# EasyEDA Pro project ProPrj_NavBot-EN01_2025-11-07.epro, board SERVO_DEBUG
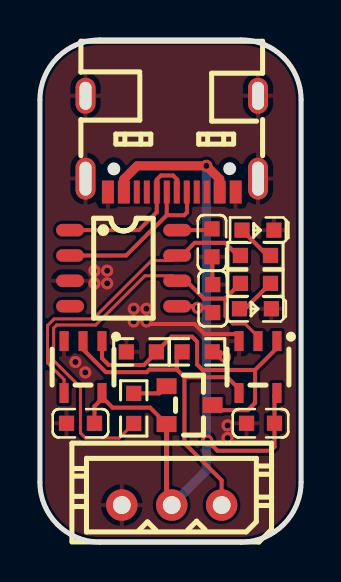
[diagram p10: board, top side]
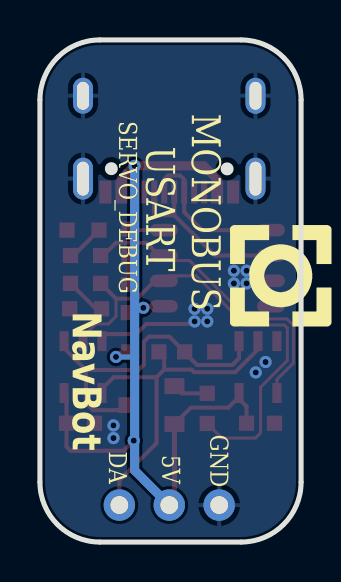
[diagram p11: board, bottom side, seen from below]

Outline 13.08 x 25.15 mm; copper layers: Top Layer, Bottom Layer. Coordinates in mm from the lower left corner of the outline.
Outline path: 0,22.15 0,3 arc(0.88,0.88) 3,0 10.08,0 arc(12.2,0.88) 13.08,3 13.08,22.15 arc(12.2,24.27) 10.08,25.15 3,25.15 arc(0.88,24.27) 0,22.15
Stack: Top Layer 0.035mm / Dielectric1 1.51mm FR4 er 4.5 / Bottom Layer 0.035mm

## Design rules (mm)
template: 用户自定义配置
spacing Default (default): track to track 0.152, other pairs 0 to 0.152
track width Default (default): min 0.127, default 0.254, max 25.4
differential pair differentialPair (default): width min 0.127, default 0.254, max 2.54; gap min 0.152, default 0.152
via Default (default): diameter min 0.61, default 0.61, max 100.025; hole min 0.305, default 0.305, max 59.995

## Placement (name value [footprint] x y rotation side)
C1  100nF  [C0603]  8.64 12.19 270 top
C2  100nF  [C0603]  8.64 14.99 90 top
C3  100nF  [C0603]  2.03 5.97 180 top
C4  100nF  [C0603]  11.05 5.97 180 top
H2  -  [5264-3A]  11.6 4.95 180 top
LED1  KT-0603R  [LED0603-RD]  10.92 15.62 180 top
LED2  KT-0603R  [LED0603-RD]  10.8 11.68 180 top
Q1  SS8550  [SOT-23_L2.9-W1.3-P0.95-LS2.4-BR]  7.49 6.86 180 top
R1  1kΩ  [R0603]  7.87 9.53 0 top
R2  1kΩ  [R0603]  5.08 9.53 0 top
R5  1kΩ  [R0603]  4.7 6.69 270 top
R6  1kΩ  [R0603]  10.8 14.35 180 top
R7  1kΩ  [R0603]  10.8 12.95 180 top
U2  SN74LVC1G126DBVR  [SOT-23-5_L3.0-W1.7-P0.95-LS2.8-BR]  10.92 8.76 90 top
U3  SN74LVC1G125DBVR  [SOT-23-5_L3.0-W1.7-P0.95-LS2.8-BR]  2.16 8.76 90 top
U4  CH340N  [SOP-8_L4.9-W3.9-P1.27-LS6.0-BL]  4.19 13.72 270 top
USB1  TYPEC-304-ACP16  [USB-C-SMD_TYPE-C-16P-1]  6.6 19.94 180 top

## Footprints (pads in the part's own frame, mm; a bottom-side part is the same pattern mirrored in y, then rotated)
5264-3A
  round 1.575 hole 0.889: 1(2.5,3.1) 2(5,3.1) 3(7.5,3.1)
C0603
  rect 0.762x0.762 smd: 1(-0.7,0.019) 2(0.7,0.019)
LED0603-RD
  rect 0.762x0.762 smd: 1(-0.799,0) 2(0.799,0)
R0603
  rect 0.762x0.762 smd: 1(-0.753,0) 2(0.753,0)
SOP-8_L4.9-W3.9-P1.27-LS6.0-BL
  oval 0.63x1.4 smd: 1(-1.905,-2.683) 2(-0.635,-2.683) 3(0.635,-2.683) 4(1.905,-2.683) 5(1.905,2.683) 6(0.635,2.683) 7(-0.635,2.683) 8(-1.905,2.683)
SOT-23-5_L3.0-W1.7-P0.95-LS2.8-BR
  rect 1x0.457 smd: 1(1.3,-0.95) 2(1.3,0) 3(1.3,0.95) 4(-1.3,0.95) 5(-1.3,-0.95)
SOT-23_L2.9-W1.3-P0.95-LS2.4-BR
  rect 1x0.8 smd: 1(1.15,-0.95) 2(1.15,0.95) 3(-1.15,0)
USB-C-SMD_TYPE-C-16P-1
  rect 0.6x1.15 smd: A1B12(-3.2,2.41) A4B9(-2.4,2.41) B1A12(3.2,2.41) B4A9(2.4,2.41)
  rect 0.3x1.15 smd: A5(-1.25,2.41) A6(-0.25,2.41) A7(0.25,2.41) A8(1.25,2.41) B5(1.75,2.41) B6(0.75,2.41) B7(-0.75,2.41) B8(-1.75,2.41)
  oval 1x2.1 hole 0.6x1.7: EP(-4.32,1.74) EP(4.32,1.74)
  oval 1x1.8 hole 0.6x1.4: EP(-4.32,-2.41) EP(4.32,-2.41)

## Nets
As in the schematic.

Pads without a net: U4 4; USB1 A5 A8 B5 B8

## Via types
v1: diameter 0.61, hole 0.305, Top Layer to Bottom Layer, 16 vias

## Routing (per net, layer and track width the routed paths; a pad name or vN(x,y) marks a point on that pad's centre or on a via; arc(x,y) is an arc through that point)
GND: length 6.6
  Top Layer w0.203: U2.3 9.97,10.41 8.26,10.41 7.75,10.92 5.46,10.92 v1(5.33,11.05) ; 8.64,14.29 8.64,12.89
  vias: v1(1.78,9.02) v1(2.27,8.49) v1(2.73,13.59) v1(2.73,12.95) v1(3.37,13.59) v1(3.37,12.95) v1(4.7,11.68) v1(4.7,11.05) v1(5.33,11.68) v1(9.4,5.84) v1(9.4,5.21)
VIN: length 44
  Top Layer w0.203: 3.11,7.26 3.64,6.73 5.52,6.73 Q1.2 ; 3.11,7.26 U3.5 ; 3.11,7.26 3.11,7.17 2.73,6.8 2.73,5.97 ; U2.5 11.75,7.34 11.75,4.78 11.55,4.57 8.89,4.57 v1(8.38,5.08) ; 8.64,11.49 8.4,11.73 v1(7.9,11.73) 7.82,11.81 6.87,11.81 ; R1.2 9.02,9.53 v1(9.27,9.27)
  Top Layer w0.254: 6.6,1.85 6.34,2.11 Q1.2
  Top Layer w0.457: 4.2,17.53 4.2,18.17 4.87,18.84 v1(8.34,18.84) 9,18.17 9,17.53
  Bottom Layer w0.254: 8.34,9.31 8.38,9.27 v1(9.27,9.27)
  Bottom Layer w0.457: 6.6,1.85 8.34,3.59 v1(8.34,18.84)
D+: length 8.2
  Top Layer w0.203: U4.1 4.95,15.62 5.85,16.52 5.85,18.15 6.06,18.36 6.67,18.36 6.87,18.15 6.87,17.55 6.85,17.53
D-: length 8.9
  Top Layer w0.203: 6.35,16.37 7.22,16.37 7.37,16.51 7.37,17.52 7.35,17.53 ; 6.35,16.37 6.35,16.37 6.35,17.53 ; 6.35,16.37 5.48,15.49 5.46,15.49 4.32,14.35 U4.2
DATA: length 17.5
  Top Layer w0.203: R1.1 6.86,9.26 6.86,8.64 ; 6.86,8.64 5.48,8.64 5.35,8.51 3.3,8.51 2.16,9.65 U3.2 ; 6.86,8.64 7.24,8.25 ; 7.24,8.25 7.24,4.95 9.1,3.09 9.1,1.85 ; 7.24,8.25 9.39,8.25 9.97,7.67 U2.4
SERVO_RX: length 15.4
  Top Layer w0.152: U4.7 6.62,14.1 5.59,14.1 2.67,11.18 0.71,11.18 0.38,10.84 0.38,8.97 1.21,8.14 1.21,7.46
  Top Layer w0.203: U4.7 7.11,14.35 7.75,14.99 9.27,14.99 9.91,14.35 R6.2
SERVO_TX: length 23.3
  Top Layer w0.152: 4.7,5.94 3.97,5.21 2.29,5.21 2.03,5.46 2.03,7.75 0.69,9.09 0.69,10.72 0.84,10.87 2.79,10.87 5.26,13.33 6.62,13.33 U4.6 ; 9.27,12.19 9.27,11.3 9.65,10.92 10.29,10.92 10.92,10.29 U2.2
  Top Layer w0.203: R7.2 10.03,12.95 9.27,12.19 8.22,12.19 7.33,13.08 U4.6
TXEN: length 16.7
  Top Layer w0.203: U2.1 11.87,9.71 10.78,8.62 ; Q1.3 8.64,6.6 10.41,6.6 10.78,6.97 10.78,8.62 ; 10.78,8.62 8.14,8.62 7.87,8.89 7.87,10.03 7.62,10.29 6.6,10.29 R2.2 5.83,9.49 5.21,8.86 3.45,8.86 3.11,9.2 U3.1
$1N3846: length 1.8
  Top Layer w0.203: R5.1 5.98,7.45 Q1.1
$1N3866: length 2
  Top Layer w0.203: LED1.2 11.39,14.35 R6.1
$1N3867: length 2.1
  Top Layer w0.203: LED2.2 10.28,11.68 R7.1
$1N4538: length 1.8
  Top Layer w0.203: 8.64,15.69 8.57,15.62 U4.8

## Copper pours and planes (outline as drawn; the poured copper is in the pictures)
GND on Top Layer: -0.89,26.16 16.76,26.16 16.76,-0.25 -0.89,-0.25
GND on Bottom Layer: -0.25,25.53 13.34,25.53 13.34,-0.25 -0.25,-0.25

## Text on the board
Bottom Solder Mask Layer: 7/9/25
Bottom Silkscreen Layer: GND | 5V | SERVO_DEBUG | DA | MONOBUS | USART | NavBot
